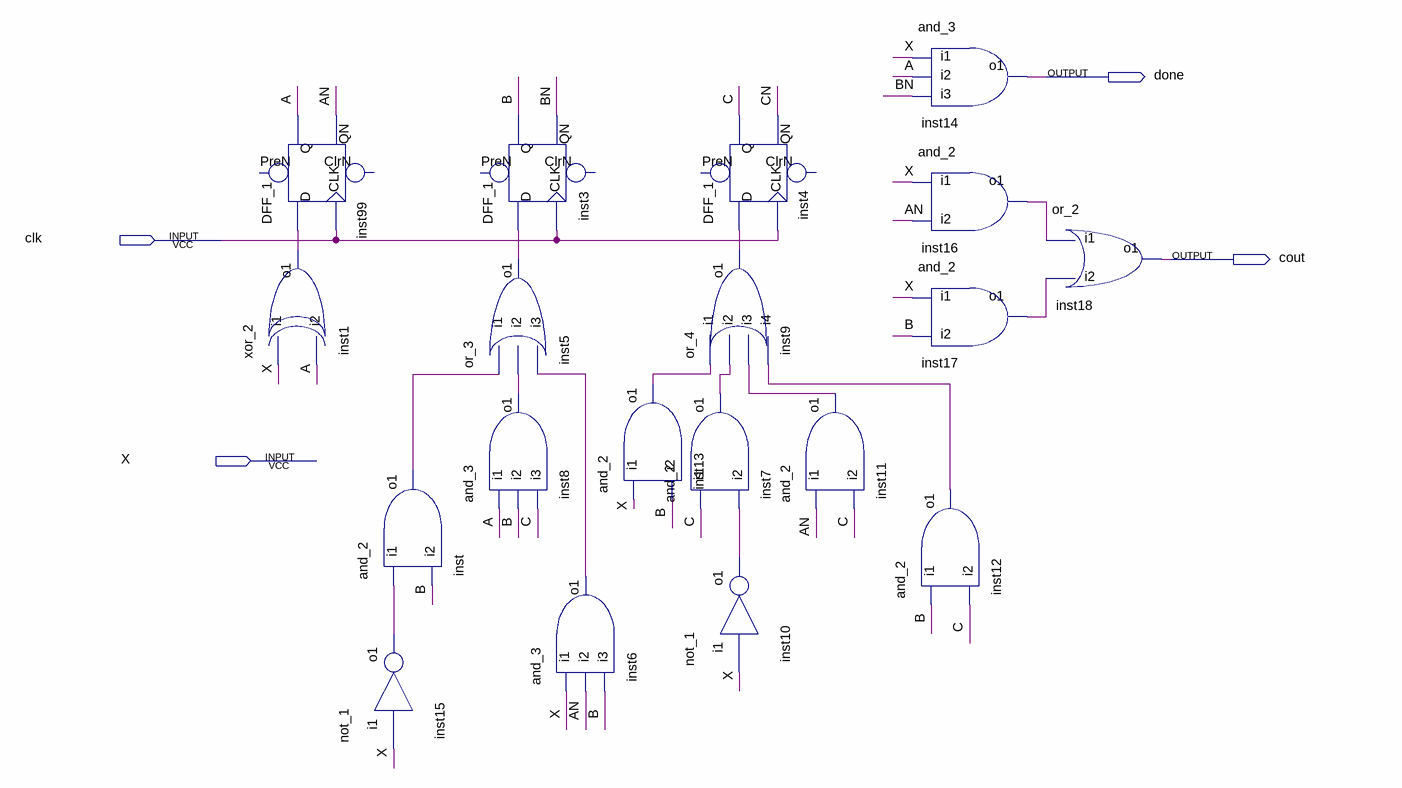
[diagram p0: schematic sheet]
// Quartus schematic counter.bdf as structural Verilog: 19 symbols, 4 pins
module counter (
  input  clk,
  input  X,
  output done,
  output cout
);

  wire A, AN, B, BN, C, CN, inst1_o1, inst5_o1, inst6_o1, inst7_o1, inst8_o1, inst9_o1, inst10_o1, inst11_o1,
       inst12_o1, inst13_o1, inst15_o1, inst16_o1, inst17_o1, inst_o1;

  xor_2 inst1 (.i1(X), .i2(A), .o1(inst1_o1));
  DFF_1 inst99 (.CLK(clk), .D(inst1_o1), .QN(AN), .Q(A));  // open: PreN, ClrN
  and_2 inst (.i1(inst15_o1), .i2(B), .o1(inst_o1));
  not_1 inst15 (.i1(X), .o1(inst15_o1));
  or_3 inst5 (.i1(inst_o1), .i2(inst8_o1), .i3(inst6_o1), .o1(inst5_o1));
  and_3 inst8 (.i1(A), .i2(B), .i3(C), .o1(inst8_o1));
  DFF_1 inst3 (.CLK(clk), .D(inst5_o1), .QN(BN), .Q(B));  // open: PreN, ClrN
  and_3 inst6 (.i1(X), .i2(AN), .i3(B), .o1(inst6_o1));
  and_2 inst13 (.i1(X), .i2(B), .o1(inst13_o1));
  DFF_1 inst4 (.CLK(clk), .D(inst9_o1), .QN(CN), .Q(C));  // open: PreN, ClrN
  or_4 inst9 (.i1(inst13_o1), .i2(inst7_o1), .i3(inst11_o1), .i4(inst12_o1), .o1(inst9_o1));
  and_2 inst7 (.i1(C), .i2(inst10_o1), .o1(inst7_o1));
  not_1 inst10 (.i1(X), .o1(inst10_o1));
  and_2 inst11 (.i1(AN), .i2(C), .o1(inst11_o1));
  and_3 inst14 (.i1(X), .i2(A), .i3(BN), .o1(done));
  and_2 inst16 (.i1(X), .i2(AN), .o1(inst16_o1));
  and_2 inst17 (.i1(X), .i2(B), .o1(inst17_o1));
  and_2 inst12 (.i1(B), .i2(C), .o1(inst12_o1));
  or_2 inst18 (.i1(inst16_o1), .i2(inst17_o1), .o1(cout));
endmodule
